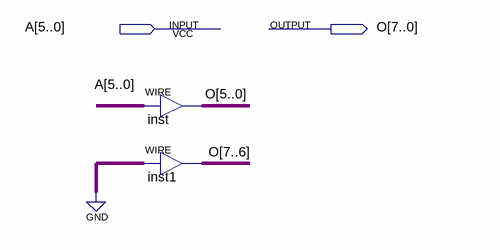
[diagram p0: schematic sheet]
// Quartus schematic g27_6bit_to_8bit_converter.bdf as structural Verilog: 2 symbols, 2 pins
module g27_6bit_to_8bit_converter (
  input  [5:0] A,
  output [7:0] O
);

  assign O[5:0] = A;  // WIRE inst
  assign O[7:6] = 2'b00;  // WIRE inst1
endmodule
